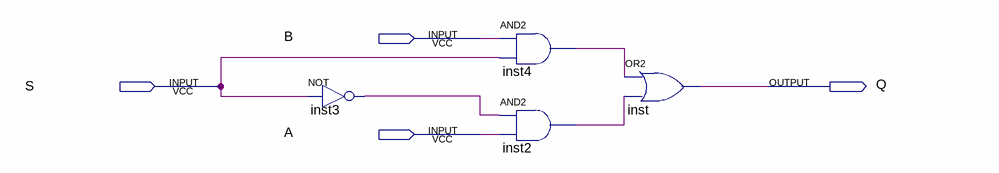
[diagram p0: schematic sheet]
// Quartus schematic mux1Bit2Way.bdf as structural Verilog: 4 symbols, 4 pins
module mux1Bit2Way (
  input  B,
  input  S,
  input  A,
  output Q
);

  wire inst2_out, inst3_out, inst4_out;

  not inst3 (inst3_out, S);
  and inst4 (inst4_out, B, S);
  and inst2 (inst2_out, inst3_out, A);
  or inst (Q, inst4_out, inst2_out);
endmodule
